# Altium schematic sheet PowerRail.SchDoc
size 420 x 297 mm; SheetNumber: 5; SheetTotal: 7
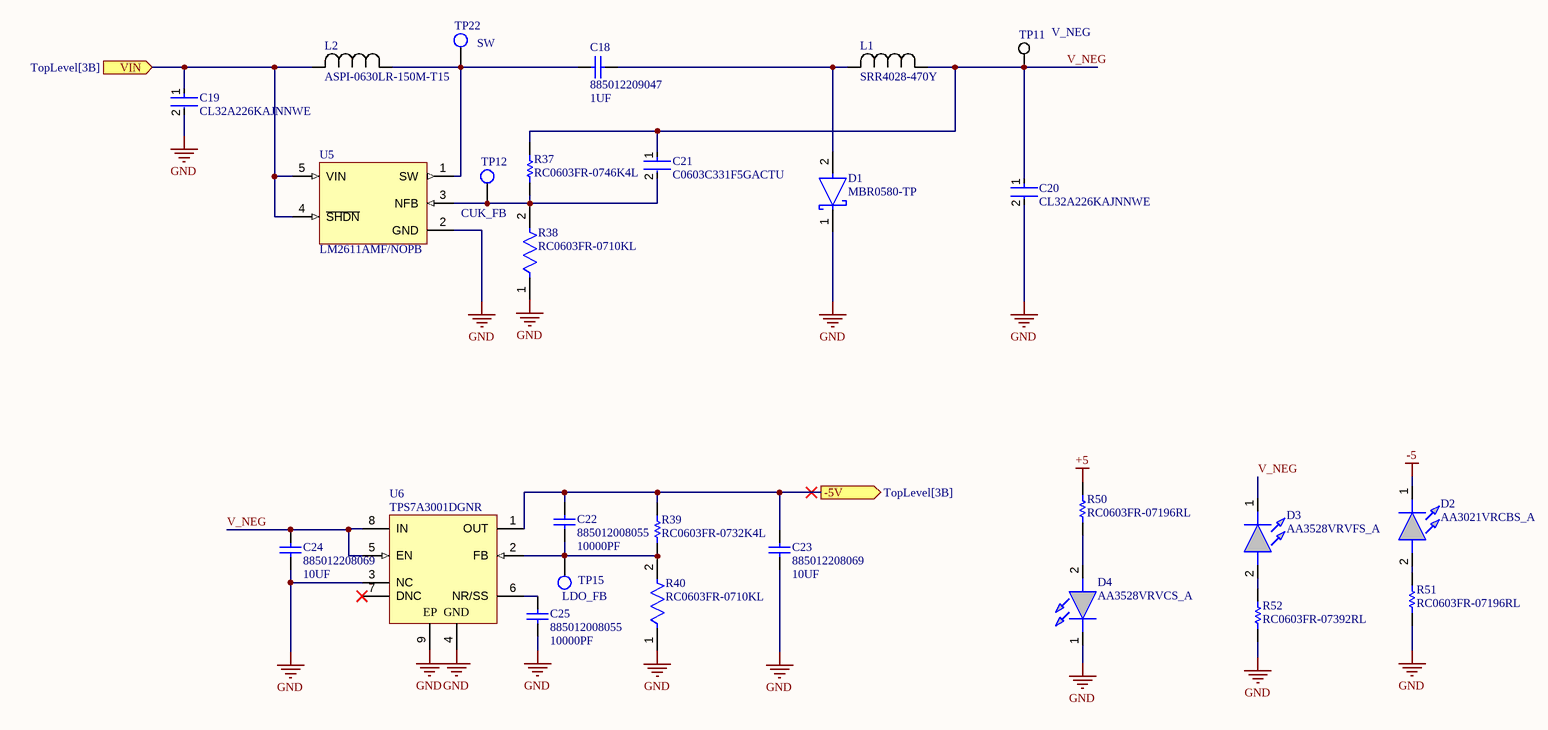
[diagram p0: PowerRail.SchDoc]

## Parts
C18  885012209047  value 1UF  [1210]
C19  CL32A226KAJNNWE  [FP-CL32-IPC_B]
C20  CL32A226KAJNNWE  [FP-CL32-IPC_B]
C21  C0603C331F5GACTU  [FP-C0603C-CF-MFG]
C22  885012008055  value 10000PF  [1206]
C23  885012208069  value 10UF  [1206]
C24  885012208069  value 10UF  [1206]
C25  885012008055  value 10000PF  [1206]
D1  MBR0580-TP  [FP-SOD-123-IPC_C]
D2  AA3021VRCBS_A  [LEDM3020X150N]
D3  AA3528VRVFS_A  [AA3528VRVFSA]
D4  AA3528VRVCS_A  [AA3528VRVFSA]
L1  SRR4028-470Y  [IND_BOURNS_SRR4028]
L2  ASPI-0630LR-150M-T15  [IND_ASPI-0630LR_ABR]
R37  RC0603FR-0746K4L  [RESC0603(1608)_N]
R38  RC0603FR-0710KL  [FP-RC0603-0_55-IPC_C]
R39  RC0603FR-0732K4L  [RESC1608X55X25ML10T15]
R40  RC0603FR-0710KL  [FP-RC0603-0_55-IPC_C]
R50  RC0603FR-07196RL  [RESC1608X55X25NL10T15]
R51  RC0603FR-07196RL  [RESC1608X55X25NL10T15]
R52  RC0603FR-07392RL  [RESC1608X55X25ML10T15]
TP11  V_NEG  [KSTN-5019_V]
TP12  CUK_FB  [TP-PAD]
TP15  LDO_FB  [TP-PAD]
TP22  SW  [TP-PAD]
U5  LM2611AMF/NOPB  [DBV0005A_N]
U6  TPS7A3001DGNR  [DGN0008D_L]

## Ports
-5V (out, see TopLevel[3B]), VIN (in, see TopLevel[3B])

## Nets
+5: R50.2
-5: D2.1(K)
GND: C19.2 C20.2 C23.1 C24.1 C25.1 D1.1(C) D4.1(K) R38.1 R40.1 R51.1 R52.1 U5.2(GND) U6.3(NC) U6.4(GND) U6.9(EP)
-5V: C22.2 C23.2 R39.2 U6.1(OUT) ; port -5V
V_NEG: C20.1 C21.1 C24.2 D3.1(K) L1.1 R37.2 TP11.1 U6.5(EN) U6.8(IN)
VIN: C19.1 L2.2 U5.4(~{SHDN}) U5.5(VIN) ; port VIN
NetC18_1: C18.1 D1.2(A) L1.2
NetC18_2: C18.2 L2.1 TP22.1 U5.1(SW)
NetC21_2: C21.2 R37.1 R38.2 TP12.1 U5.3(NFB)
NetC22_1: C22.1 R39.1 R40.2 TP15.1 U6.2(FB)
NetC25_2: C25.2 U6.6(NR/SS)
NetD2_2: D2.2(A) R51.2
NetD3_2: D3.2(A) R52.2
NetD4_2: D4.2(A) R50.1

Not connected (* = marked no-connect by the designer): U6 7(DNC)*

## Notes on the sheet
- THIS DOCUMENT AND THE DATA DISCLOSED HEREIN OR
- HEREWITH IS THE PROPERTY OF ALTIUM LIMITED AND MAY
- DWG NO:
- REVISION
- REV:
- DESCRIPTION
- DATE
- APPROVED
- BE FREELY DISTRIBUTED IN WHOLE. NO RIGHTS ARE
- RESERVED OR EXPRESS OR IMPLIED WARANTEE GIVEN.
- ENG:
- APPROVALS
- PROJECT
- DSN:
- CHK:
- REFERENCE DOCUMENTS
- PROJECT REVISION:
- TITLE
- DOCUMENT REVISION:
- DESIGN ITEM:
- BOM:
- FAB DWG:
- PCB DWG:
- ASSY DWG:
- SCALE:
- A3
- SIZE
- CAGE CODE
- FILE NAME
- DWG NO.
- SHEET
- OF
- REV

## Library data of the parts
C18 = CAP CER 1UF 50V X7R 1210: Capacitor; Designator: C?; Voltage Rating: 50V; Published: 8-Jun-2000; LatestRevisionDate: 17-Jul-2002; LatestRevisionNote: Re-released for DXP Platform.; Publisher: Altium Limited; Manufacturer Part Number: 885012209047
C19 C20 = CMP-13271-000793-1: Cap Ceramic 22uF 25V X5R ±10% SMD 1210 +85°C Embossed T/R; Voltage Rating: 25V; Lead Free: Lead Free; Case Code (Imperial): 1210; Case Code (Metric): 3225; Capacitance: 22uF; Mount: Surface Mount; Max Operating Temperature: 85°C; Thickness: 0.106inch; Width: 0.098inch; Packaging: Cut Tape; Package Quantity: 1; Tolerance: 10%; Length: 0.126inch; Min Operating Temperature: -55°C; Case/Package: 1210
C21 = CMP-1035-01569-3: CAP CER 330PF 50V 1% NP0 0603; Manufacturer: KEMET; Temperature Coefficient: 30ppm/°C; Temperature Characteristic: C0G; Material: Ceramic; Tolerance: 0.01; Automotive Grade: Grade 1; Voltage Rating: 50 V; Temperature: -55°C to +125°C; Temperature Range High: +125°C; ComponentLink2Description: Datasheet; Automotive: Yes; Octopart: https://octopart.com/c0603c331f5gactu-kemet-9142706; Temperature Range Low: -55°C; Value: 330 pF; ComponentLink2URL: https://api.kemet.com/component-edge/download/datasheet/C0603C100J5GACAUTO.pdf; Device Class L1: Passive Components; Mouser Description: Multilayer Ceramic Capacitors MLCC - SMD/SMT 50volts 330pF C0G 1%; Capacitance: 330 pF; Device Class L3: Ceramic Capacitors; Manufacturer Part Number: C0603C331F5GACTU; Height: 0.87mm; RoHS: TRUE; Device Class L2: Capacitors; Package: C0603C-CF; Digikey Description: CAP CER 330PF 50V 1% NP0 0603; Category: Cap; Lead Free: Yes
C22 C25 = CAP CER 10000PF 50V C0G/NP0 1206: Capacitor; Designator: C?; Voltage Rating: 50V; Published: 8-Jun-2000; LatestRevisionDate: 17-Jul-2002; LatestRevisionNote: Re-released for DXP Platform.; Publisher: Altium Limited; Manufacturer Part Number: 885012008055
C23 C24 = CAP CER 10UF 25V X7R 1206: Capacitor; Designator: C?; Voltage Rating: 25V; Published: 8-Jun-2000; LatestRevisionDate: 17-Jul-2002; LatestRevisionNote: Re-released for DXP Platform.; Publisher: Altium Limited; Manufacturer Part Number: 885012208069
D1 = CMP-56206-000006-1: DIODE SCHOTTKY 80V 500MA SOD123; Max Power Dissipation: 410mW; Max Reverse Leakage Current: 200uA; Max Surge Current: 5.5A; Forward Voltage: 800mV; Min Operating Temperature: -55°C; Packaging: Tape and Reel; Max Operating Temperature: 150°C; Lead Free: Lead Free; Peak Reverse Current: 200uA; Mount: Surface Mount; Max Reverse Voltage (DC): 80V; Package Quantity: 1; Max Repetitive Reverse Voltage (Vrrm): 80V; Average Rectified Current: 500mA
D2 = AA3021VRCBS_A: 3.0x2.0mm Blue Lagoon SMD LED (X=0.19, Y=0.37); Manufacturer_Name: Kingbright; Manufacturer_Part_Number: AA3021VRCBS/A; Geometry.Height: 1.5mm; Mouser Part Number: 604-AA3021VRCBSA; Mouser Price/Stock: https://www.mouser.co.uk/ProductDetail/Kingbright/AA3021VRCBS-A?qs=xhbEVWpZdWfh%2FUbhtEnz2w%3D%3D; Arrow Part Number: AA3021VRCBS/A; Arrow Price/Stock: https://www.arrow.com/en/products/aa3021vrcbsa/kingbright; Datasheet Link: https://www.arrow.com/en/products/aa3021vrcbsa/kingbright
D3 = AA3528VRVFS_A: LED Uni-Color Violet 2-Pin SMD T/R; Manufacturer_Name: Kingbright; Manufacturer_Part_Number: AA3528VRVFS/A; Geometry.Height: 2.1mm; Mouser Part Number: 604-AA3528VRVFS/A; Mouser Price/Stock: https://www.mouser.co.uk/ProductDetail/Kingbright/AA3528VRVFS-A?qs=rY7msk5yxfb63mh907EyRA%3D%3D; Arrow Part Number: AA3528VRVFS/A; Arrow Price/Stock: https://www.arrow.com/en/products/aa3528vrvfsa/kingbright?region=nac; Datasheet Link: https://mouser.componentsearchengine.com/Datasheets/1/AA3528VRVFS_A.pdf
D4 = AA3528VRVCSA: LED Uni-Color Pink 2-Pin SMD T/R; Manufacturer_Name: Kingbright; Manufacturer_Part_Number: AA3528VRVCS/A; Geometry.Height: 2.1mm; Mouser Part Number: 604-AA3528VRVFS/A; Mouser Price/Stock: https://www.mouser.co.uk/ProductDetail/Kingbright/AA3528VRVFS-A?qs=rY7msk5yxfb63mh907EyRA%3D%3D; Arrow Part Number: AA3528VRVCS/A; Arrow Price/Stock: https://www.arrow.com/en/products/aa3528vrvfsa/kingbright?region=nac; Datasheet Link: https://mouser.componentsearchengine.com/Datasheets/1/AA3528VRVFS_A.pdf
L1 = SRR4028-470Y: No Description Available; Mfr_Name: Bourns Electronics
L2 = ASPI-0630LR-150M-T15: No Description Available; Mfr_Name: Abracon; Type: Fixed Inductors
R37 = CMP-1012-00698-1: 46K4 0.1W 1% 0603 (1608 Metric)  SMD / RC0603FR-0746K4L Yageo; Case-Metric: 1608; Case-EIA: 0603; Value: 46400.00 Ohm; Technology: SMT; Tolerance: 1 %; Power: 0.1 W
R38 R40 = CMP-2100-03664-2: RES 10K OHM 1% 1/10W 0603; Voltage Rating: 75V; Voltage Rating (DC): 50V; Resistance: 10kR; Power Rating: 100mW; Temperature Coefficient: 100ppm/°C; Depth: 0.8mm; Termination: SMD/SMT; Resistor Type: Thick Film; Series: RC; Construction: Rectangular; Features: Moisture Resistant; Packaging: Tape and Reel; Min Operating Temperature: -55°C; Number of Terminations: 2; Lead Pitch: 0.3mm; RoHS Compliant: Yes; Case/Package: 0603; Resistance Tolerance: 1%; Military Standard: Not; Weight: 7.1E-05oz; Number of Pins: 2; Tolerance: 1%; Length: 1.6mm; Case Code (Imperial): 0603; Lead Free: Lead Free; Width: 0.8mm; Max Power Dissipation: 100mW; Height: 0.45mm; Max Operating Temperature: 155°C; Case Code (Metric): 1608; Size Code: 0603
R39 = CMP-2000-04011-1: Manufacturer: Yageo; Part Number: RC0603FR-0732K4L
R50 R51 = CMP-2000-03929-1: Manufacturer: Yageo; Part Number: RC0603FR-07196RL
R52 = CMP-1012-00464-2: Manufacturer: Yageo; Part Number: RC0603FR-07392RL
TP11 = CMP-1672-00008-1: Test Point, 1 Position SMD, RoHS, Tape and Reel; ComponentLink1Description: Manufacturer URL; Package Quantity: 1000; DatasheetVersion: 03/2014; Packaging: Tape and Reel; ComponentLink2URL: http://www.keyelco.com/product-pdf.cfm?p=1357; ComponentLink1URL: http://www.keyelco.com/; Mount: Surface Mount; Contact Plating: Silver; PackageDescription: 1-Pin Surface Mount Device, Body 3.81 x 2.03 mm; Pins: 1; RoHSCompliant: True; Mounting Technology: Surface Mount; ComponentLink2Description: Datasheet; PackageReference: 5019
TP12 TP15 TP22 = TP-PAD
U5 = CMP-0069-01160-3: 1.4MHz Cuk Converter, 5-pin SOT-23, Pb-Free; Manufacturer: Texas Instruments; PowerWise: N; CompType: Switcher; PackageTopMarking: S40A*XTT; ComponentLink1URL: http://www.ti.com/general/docs/lit/getliterature.tsp?genericPartNumber=LM2611&fileType=pdf; PackageDescription: Molded SOT-23, .115 x .063 x .040 in Body, 5 Lead, .0375 in Pitch; ComponentLink1Description: Datasheet URL; PackageReference: DBV0005A; PinCount: 5; RoHS: Y
U6 = CMP-0394-01243-2: Single Output High PSRR LDO, 200 mA, Adjustable -1.18 to -33 V Output, -3 to -36 V Input, with Ultra-Low Noise, 8-pin MSOP (DGN), -40 to 125 degC, Green (RoHS & no Sb/Br); Manufacturer: Texas Instruments; Vdo(Typ)(mV): 216; Iq(Typ)(mA): 0.05; Iout(Max)(A): 0.2; SubFamily: Single Channel LDO; Accuracy(%): 1.5; PartNumber: TPS7A3001DGNR; PackageVersion: 4073271/F; Vin(Max)(V): -36; PackageDescription: 8-pin Plastic Small Outline, Body 3 x 3 mm, Pitch 0.65 mm; Code_JEDEC: MO-187; Vout Adj(Min)(V): -1.18; Mounting Technology: Surface Mount; ComponentLink1URL: http://www.ti.com/; ComponentLink3Description: Package Specification; Eco-Plan: Green (RoHS & no Sb/Br); PackageReference: DGN0008D; ComponentLink3URL: http://www.ti.com/litv/pdf/mpds046e; Vout Adj(Max)(V): -33; Vin(Min)(V): -3; ComponentLink1Description: Manufacturer URL; ComponentLink2URL: http://www.ti.com/general/docs/lit/getliterature.tsp?genericPartNumber=TPS7A3001&fileType=pdf; ComponentLink2Description: Datasheet; DatasheetVersion: SBVS125A